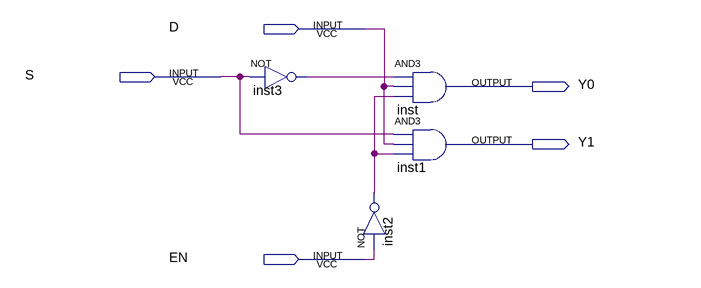
[diagram p0: schematic sheet]
// Quartus schematic DMUX21.bdf as structural Verilog: 4 symbols, 5 pins
module DMUX21 (
  input  D,
  input  S,
  input  EN,
  output Y0,
  output Y1
);

  wire inst2_out, inst3_out;

  not inst3 (inst3_out, S);
  and inst (Y0, inst3_out, D, inst2_out);
  and inst1 (Y1, S, D, inst2_out);
  not inst2 (inst2_out, EN);
endmodule
